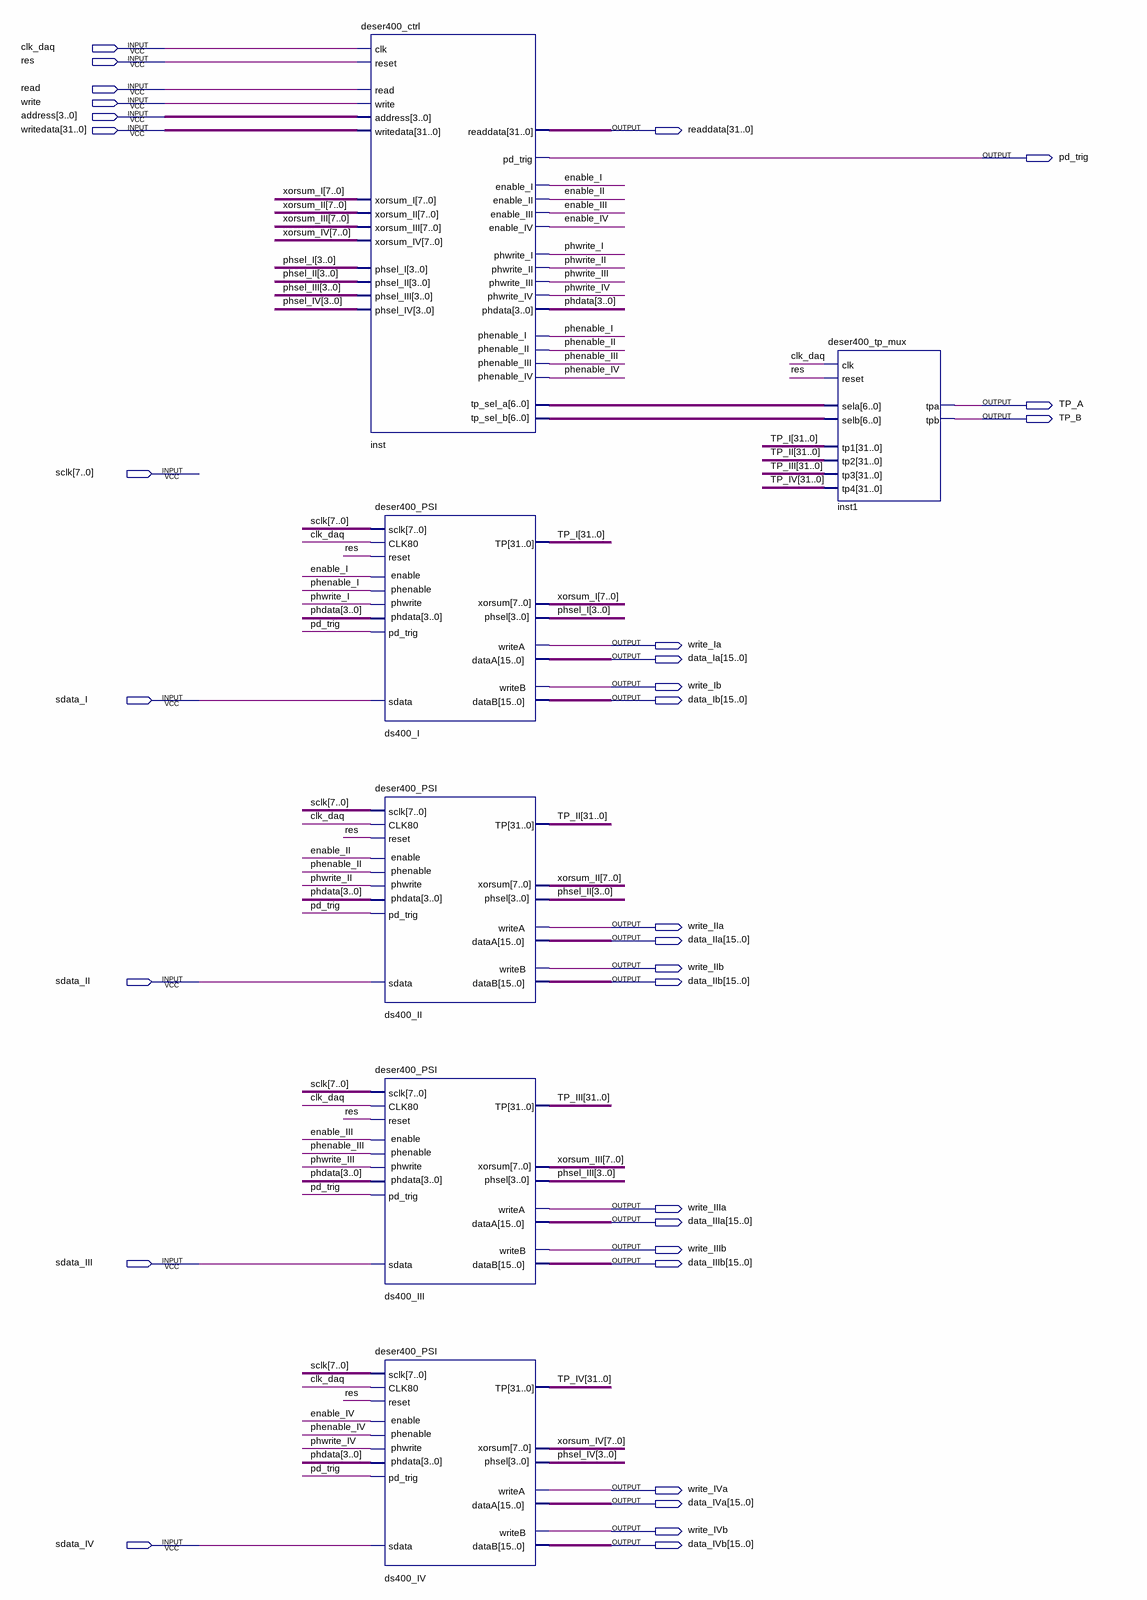
[diagram p0: schematic sheet]
// Quartus schematic deser_tbm.bdf as structural Verilog: 6 symbols, 31 pins
module deser_tbm (
  input  clk_daq,
  input  res,
  input  read,
  input  write,
  input  [3:0] address,
  input  [31:0] writedata,
  input  [7:0] sclk,
  input  sdata_I,
  input  sdata_II,
  input  sdata_III,
  input  sdata_IV,
  output [31:0] readdata,
  output pd_trig,
  output TP_A,
  output TP_B,
  output write_Ia,
  output [15:0] data_Ia,
  output write_Ib,
  output [15:0] data_Ib,
  output write_IIa,
  output [15:0] data_IIa,
  output write_IIb,
  output [15:0] data_IIb,
  output write_IIIa,
  output [15:0] data_IIIa,
  output write_IIIb,
  output [15:0] data_IIIb,
  output write_IVa,
  output [15:0] data_IVa,
  output write_IVb,
  output [15:0] data_IVb
);

  wire enable_I, enable_II, enable_III, enable_IV, phenable_I, phenable_II, phenable_III, phenable_IV,
       phwrite_I, phwrite_II, phwrite_III, phwrite_IV;
  wire [3:0] phdata, phsel_I, phsel_II, phsel_III, phsel_IV;
  wire [6:0] inst_tp_sel_a, inst_tp_sel_b;
  wire [7:0] xorsum_I, xorsum_II, xorsum_III, xorsum_IV;
  wire [31:0] TP_I, TP_II, TP_III, TP_IV;

  deser400_ctrl inst (
    .clk(clk_daq), .reset(res), .read(read), .write(write), .writedata(writedata), .xorsum_I(xorsum_I),
    .xorsum_II(xorsum_II), .xorsum_III(xorsum_III), .xorsum_IV(xorsum_IV), .address(address),
    .phsel_I(phsel_I), .phsel_II(phsel_II), .phsel_III(phsel_III), .phsel_IV(phsel_IV), .readdata(readdata),
    .enable_I(enable_I), .enable_II(enable_II), .enable_III(enable_III), .enable_IV(enable_IV),
    .phwrite_I(phwrite_I), .phwrite_II(phwrite_II), .phwrite_III(phwrite_III), .phwrite_IV(phwrite_IV),
    .phenable_IV(phenable_IV), .phenable_III(phenable_III), .phenable_II(phenable_II),
    .phenable_I(phenable_I), .phdata(phdata), .tp_sel_a(inst_tp_sel_a), .tp_sel_b(inst_tp_sel_b),
    .pd_trig(pd_trig));
  deser400_PSI ds400_I (
    .sclk(sclk), .CLK80(clk_daq), .reset(res), .sdata(sdata_I), .phwrite(phwrite_I), .enable(enable_I),
    .phenable(phenable_I), .phdata(phdata), .pd_trig(pd_trig), .writeA(write_Ia), .dataA(data_Ia),
    .writeB(write_Ib), .dataB(data_Ib), .xorsum(xorsum_I), .phsel(phsel_I), .TP(TP_I));
  deser400_PSI ds400_II (
    .sclk(sclk), .CLK80(clk_daq), .reset(res), .sdata(sdata_II), .phwrite(phwrite_II), .enable(enable_II),
    .phenable(phenable_II), .phdata(phdata), .pd_trig(pd_trig), .writeA(write_IIa), .dataA(data_IIa),
    .writeB(write_IIb), .dataB(data_IIb), .xorsum(xorsum_II), .phsel(phsel_II), .TP(TP_II));
  deser400_PSI ds400_III (
    .sclk(sclk), .CLK80(clk_daq), .reset(res), .sdata(sdata_III), .phwrite(phwrite_III), .enable(enable_III),
    .phenable(phenable_III), .phdata(phdata), .pd_trig(pd_trig), .writeA(write_IIIa), .dataA(data_IIIa),
    .writeB(write_IIIb), .dataB(data_IIIb), .xorsum(xorsum_III), .phsel(phsel_III), .TP(TP_III));
  deser400_PSI ds400_IV (
    .sclk(sclk), .CLK80(clk_daq), .reset(res), .sdata(sdata_IV), .phwrite(phwrite_IV), .enable(enable_IV),
    .phenable(phenable_IV), .phdata(phdata), .pd_trig(pd_trig), .writeA(write_IVa), .dataA(data_IVa),
    .writeB(write_IVb), .dataB(data_IVb), .xorsum(xorsum_IV), .phsel(phsel_IV), .TP(TP_IV));
  deser400_tp_mux inst1 (
    .clk(clk_daq), .reset(res), .tp1(TP_I), .tp2(TP_II), .tp3(TP_III), .tp4(TP_IV), .sela(inst_tp_sel_a),
    .selb(inst_tp_sel_b), .tpa(TP_A), .tpb(TP_B));
endmodule
